# EAGLE design untitled (EAGLE 8.7.0)
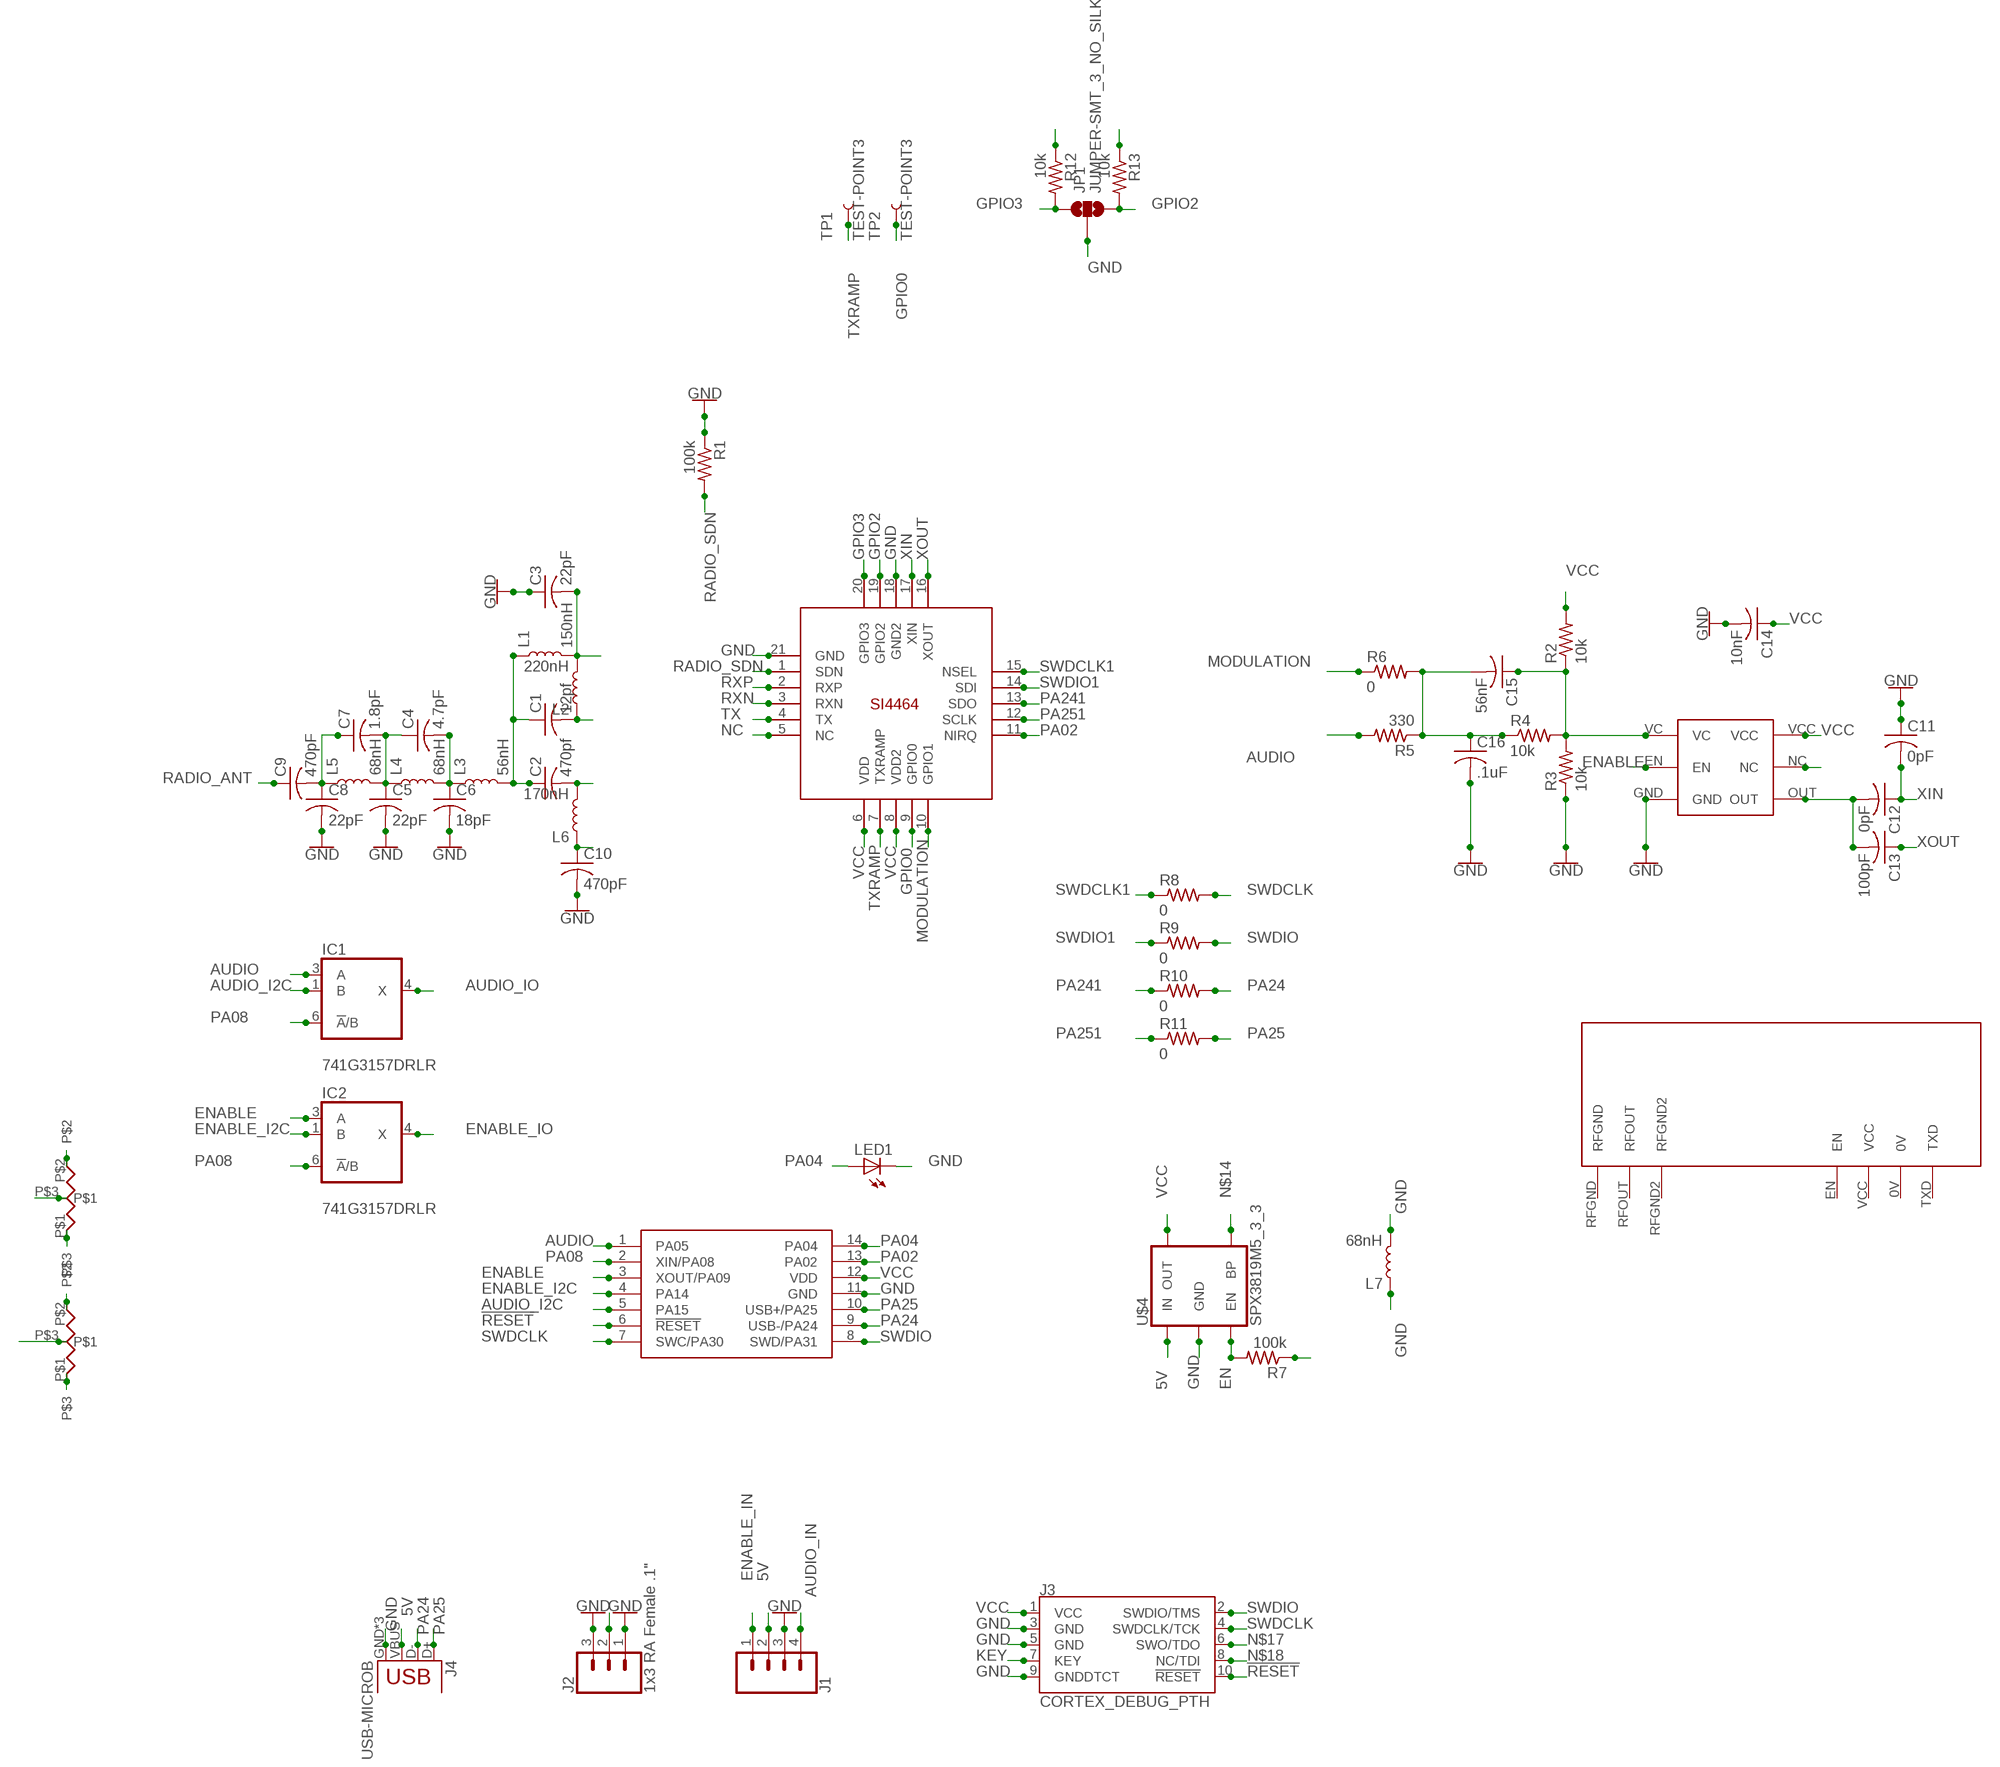
[diagram p0: schematic, sheet 1]

## Parts
C1  12pf  C-USC0402K  [C0402K]
C2  470pf  C-USC0402K  [C0402K]
C3  22pF  C-USC0402K  [C0402K]
C4  4.7pF  C-USC0402K  [C0402K]
C5  22pF  C-USC0402K  [C0402K]
C6  18pF  C-USC0402K  [C0402K]
C7  1.8pF  C-USC0402K  [C0402K]
C8  22pF  C-USC0402K  [C0402K]
C9  470pF  C-USC0402K  [C0402K]
C10  470pF  C-USC0402K  [C0402K]
C11  0pF  C-USC0402K  [C0402K]
C12  0pF  C-USC0402K  [C0402K]
C13  100pF  C-USC0402K  [C0402K]
C14  10nF  C-USC0402K  [C0402K]
C15  56nF  C-USC0402K  [C0402K]
C16  .1uF  C-USC0402K  [C0402K]
IC1  741G3157DRLR  [DRL_R-PDSO-N6]
IC2  741G3157DRLR  [DRL_R-PDSO-N6]
J1  CONN_04SMD_RA_FEMALE  [1X04_SMD_RA_FEMALE]
J2  1x3 RA Female .1"  CONN_03SMD_RA_FEMALE  [1X03_SMD_RA_FEMALE]
J3  CORTEX_DEBUG_PTH  [2X5-PTH-1.27MM]
J4  USB-MICROB  [USB-MICROB]
JP1  JUMPER-SMT_3_NO_SILK  [SMT-JUMPER_3_NO_SILK]
L1  150nH  INDUCTOR-0603-33NH  [0603]
L2  220nH  INDUCTOR-0603-33NH  [0603]
L3  56nH  INDUCTOR-0603-33NH  [0603]
L4  68nH  INDUCTOR-0603-33NH  [0603]
L5  68nH  INDUCTOR-0603-33NH  [0603]
L6  170nH  INDUCTOR-0603-33NH  [0603]
L7  68nH  INDUCTOR-0603-33NH  [0603]
LED1  LEDCHIP-LED0603  [CHIP-LED0603]
R1  100k  R-US_R0402  [R0402]
R2  10k  R-US_R0402  [R0402]
R3  10k  R-US_R0402  [R0402]
R4  10k  R-US_R0402  [R0402]
R5  330  R-US_R0402  [R0402]
R6  0  R-US_R0402  [R0402]
R7  100k  R-US_R0402  [R0402]
R8  0  R-US_R0402  [R0402]
R9  0  R-US_R0402  [R0402]
R10  0  R-US_R0402  [R0402]
R11  0  R-US_R0402  [R0402]
R12  10k  R-US_R0402  [R0402]
R13  10k  R-US_R0402  [R0402]
TP1  TEST-POINT3  [PAD.03X.03]
TP2  TEST-POINT3  [PAD.03X.03]
U$1  HC53BR-27  [OSCILLATOR-SMD-7.5X5.2-6PIN]
U$2  SI4464  [QFN20+GNDPAD]
U$3  SAMD11C14  [SOIC14]
U$4  SPX3819M5_3_3  V_REG_SPX3819-SOT23-5  [SOT23-5]
U$5  RM20A10K/20K  [RM20A10K/20K]
U$6  RM20A10K/20K  [RM20A10K/20K]
U$7  RADIOMETRIX-HX1  [RADIOMETRIX-HX1]

## Nets
5V: J1.2 J4.VBUS R7.1 U$4.1(IN)
!RESET: J3.10(!RESET) U$3.6(!RESET)
AUDIO: IC1.3(A) R5.2 U$3.1(PA05)
AUDIO_I2C: IC1.1(B) U$3.5(PA15)
AUDIO_IN: J1.4 U$6.P$1
AUDIO_IO: IC1.4(X) U$6.P$3
EN: R7.2 U$4.3(EN)
ENABLE: IC2.3(A) U$1.EN U$3.3(XOUT/PA09)
ENABLE_I2C: IC2.1(B) U$3.4(PA14)
ENABLE_IN: J1.1 U$5.P$1
ENABLE_IO: IC2.4(X) U$5.P$3
GND: C3.1 C5.2 C6.2 C8.2 C10.2 C11.1 C14.2 C16.2 J1.3 J2.1 J2.3 J3.3(GND) J3.5(GND) J3.9(GNDDTCT) J4.GND J4.MT1(GND) J4.MT2(GND) JP1.2 L7.1 L7.2 LED1.C R1.1 R3.1 U$1.GND U$2.18(GND2) U$2.21(GND) U$3.11(GND) U$4.2(GND) U$5.P$2 U$6.P$2
GPIO0: TP2.P$1 U$2.9(GPIO0)
GPIO2: JP1.3 R13.2 U$2.19(GPIO2)
GPIO3: JP1.1 R12.2 U$2.20(GPIO3)
KEY: J3.7(KEY)
MODULATION: R6.1 U$2.10(GPIO1)
N$1: C4.2 C6.1 L3.1 L4.2
N$2: C1.1 C2.1 L1.1 L3.2
N$3: C4.1 C5.1 C7.2 L4.1 L5.2
N$4: C15.2 C16.1 R4.1 R5.1 R6.2
N$5: C7.1 C8.1 C9.2 L5.1
N$6: C15.1 R2.1 R3.2 R4.2 U$1.VC
N$9: U$1.NC
N$14: U$4.4(BP)
N$17: J3.6(SWO/TDO)
N$18: J3.8(NC/TDI)
NC: U$2.5(NC )
OUT: C12.2 C13.2 U$1.OUT
PA02: U$2.11(NIRQ) U$3.13(PA02)
PA04: LED1.A U$3.14(PA04)
PA08: IC1.6(!A!/B) IC2.6(!A!/B) U$3.2(XIN/PA08)
PA24: J4.D- R10.2 U$3.9(USB-/PA24)
PA25: J4.D+ R11.2 U$3.10(USB+/PA25)
PA241: R10.1 U$2.13(SDO)
PA251: R11.1 U$2.12(SCLK)
RADIO_ANT: C9.1 J2.2
RADIO_SDN: R1.2 U$2.1(SDN)
RXN: C1.2 L2.1 U$2.3(RXN)
RXP: C3.2 L1.2 L2.2 U$2.2(RXP)
SWDCLK: J3.4(SWDCLK/TCK) R8.2 U$3.7(SWC/PA30)
SWDCLK1: R8.1 U$2.15(NSEL)
SWDIO: J3.2(SWDIO/TMS) R9.2 U$3.8(SWD/PA31)
SWDIO1: R9.1 U$2.14(SDI)
TX: C2.2 L6.2 U$2.4(TX)
TXRAMP: TP1.P$1 U$2.7(TXRAMP)
VCC: C10.1 C14.1 J3.1(VCC) L6.1 R2.2 R12.1 R13.1 U$1.VCC U$2.6(VDD) U$2.8(VDD2) U$3.12(VDD) U$4.5(OUT)
XIN: C11.2 C12.1 U$2.17(XIN)
XOUT: C13.1 U$2.16(XOUT)
Unconnected: U$7.0V U$7.EN U$7.RFGND U$7.RFGND2 U$7.RFOUT U$7.TXD U$7.VCC

## Power pins joined to a net without a drawn wire
GND: IC1.2(GND) IC2.2(GND)
VCC: IC1.5(VCC) IC2.5(VCC)

## Library data of the parts
C1-C16 = rcl:C-US: CAPACITOR, American symbol; SPICEPREFIX: C
IC1 IC2 = 74xx-little-us:74*1G3157: Single-Pole, Double-Throw Analog Switch Source: http://focus.ti.com/lit/ds/symlink/sn74lvc1g3157.pdf
J1 = SparkFun-Connectors:CONN_04: Multi connection point. Often used as Generic Header-pin footprint for 0.1 inch spaced/style header connections On any of the 0.1 inch spaced packages, you can populate with these: Break Away Headers - Straight <https://www.sparkfun.com/products/116> (PRT-00116) Break Away Male Headers - Right Angle <https://www.sparkfun.com/products/553> (PRT-00553) Female Headers <https://www.sparkfun.com/products/115> (PRT-00115) Break Away Headers - Machine Pin <https://www.sparkfun.com/products/117> (PRT-00117) Break Away Female Headers - Swiss Machine Pin <https://www.sparkfun.com/products/743> (PRT-00743) For SCREWTERMINALS and SPRING TERMINALS visit here: Screw Terimnals on SparkFun.com <https://www.sparkfun.com/search/results?term=Screw+Terminals> (5mm/3.5mm/2.54mm spacing) This device is also useful as a general connection point to wire up your design to another part of your project. Our various solder wires solder well into these plated through hole pads. Hook-Up Wire - Assortment (Stranded, 22 AWG) <https://www.sparkfun.com/products/11375> (PRT-11375) Hook-Up Wire - Assortment (Solid Core, 22 AWG) <https://www.sparkfun.com/products/11367> (PRT-11367) View the entire wire category on our website here <https://www.sparkfun.com/categories/141> Special notes: Molex polarized connector foot print use with SKU : PRT-08231 with associated crimp pins and housings. 1MM SMD Version SKU: PRT-10208; PROD_ID: CONN-12382
J2 = SparkFun-Connectors:CONN_03: Multi connection point. Often used as Generic Header-pin footprint for 0.1 inch spaced/style header connections On any of the 0.1 inch spaced packages, you can populate with these: Break Away Headers - Straight <https://www.sparkfun.com/products/116> (PRT-00116) Break Away Male Headers - Right Angle <https://www.sparkfun.com/products/553> (PRT-00553) Female Headers <https://www.sparkfun.com/products/115> (PRT-00115) Break Away Headers - Machine Pin <https://www.sparkfun.com/products/117> (PRT-00117) Break Away Female Headers - Swiss Machine Pin <https://www.sparkfun.com/products/743> (PRT-00743) Stackable Header - 3 Pin (Female, 0.1") <https://www.sparkfun.com/products/13875> (PRT-13875) For SCREWTERMINALS and SPRING TERMINALS visit here: Screw Terimnals on SparkFun.com <https://www.sparkfun.com/search/results?term=Screw+Terminals> (5mm/3.5mm/2.54mm spacing) This device is also useful as a general connection point to wire up your design to another part of your project. Our various solder wires solder well into these plated through hole pads. Hook-Up Wire - Assortment (Stranded, 22 AWG) <https://www.sparkfun.com/products/11375> (PRT-11375) Hook-Up Wire - Assortment (Solid Core, 22 AWG) <https://www.sparkfun.com/products/11367> (PRT-11367) View the entire wire category on our website here <https://www.sparkfun.com/categories/141> Special notes: Molex polarized connector foot print use with SKU : PRT-08232 with associated crimp pins and housings.; PROD_ID: CONN-10926
J3 = SparkFun-Connectors:CORTEX_DEBUG: Cortex Debug Connector - 10 pin Supports JTAG debug, Serial Wire debug, and Serial Wire Viewer. PTH and SMD connector options available. General Connector Information <http://infocenter.arm.com/help/topic/com.arm.doc.faqs/attached/13634/cortex_debug_connectors.pdf> Products: PTH Connector <http://www.digikey.com/product-detail/en/cnc-tech/3220-10-0100-00/1175-1627-ND/3883661> -via Digi-Key SparkFun PSoc <https://www.sparkfun.com/products/13229> SparkFun T <https://www.sparkfun.com/products/13810>
J4 = SparkFun-Retired:USB: USB Connectors USB-B-PTH is fully proven SKU : PRT-00139/CONN-08278 USB-miniB is fully proven SKU : PRT-00587 USB-A-PCB is untested. USB-A-H is throughly reviewed, but untested. Spark Fun Electronics SKU : PRT-00437 USB-B-SMT is throughly reviewed, but untested. Needs silkscreen touching up. USB-A-S has not been used/tested USB-MB-H has not been used/tested USB-MICROB has been used. CONN-09505; PROD_ID: CONN-09505
JP1 = SparkFun-Jumpers:JUMPER-SMT_3_NO: Normally open jumper This jumper has three pads in close proximity to each other. Apply solder to close the connection(s).
L1-L7 = SparkFun-Coils:INDUCTOR: Inductors Resist changes in electrical current. Basically a coil of wire. SparkFun Products: SparkFun Load Cell Amplifier - HX711 <https://www.sparkfun.com/products/13879> IOIO-OTG - V2.2 <https://www.sparkfun.com/products/13613>; PROD_ID: NDUC-07874; VALUE: 33nH/±5%/500mA
LED1 = adafruit:LED: LED OSRAM: - CHIPLED LG R971, LG N971, LY N971, LG Q971, LY Q971, LO R971, LY R971 LH N974, LH R974 LS Q976, LO Q976, LY Q976 LO Q996 - Hyper CHIPLED LW Q18S LB Q993, LB Q99A, LB R99A - SideLED LS A670, LO A670, LY A670, LG A670, LP A670 LB A673, LV A673, LT A673, LW A673 LH A674 LY A675 LS A676, LA A676, LO A676, LY A676, LW A676 LS A679, LY A679, LG A679 - Hyper Micro SIDELED® LS Y876, LA Y876, LO Y876, LY Y876 LT Y87S - SmartLED LW L88C, LW L88S LB L89C, LB L89S, LG L890 LS L89K, LO L89K, LY L89K LS L896, LA L896, LO L896, LY L896 - TOPLED LS T670, LO T670, LY T670, LG T670, LP T670 LSG T670, LSP T670, LSY T670, LOP T670, LYG T670 LG T671, LOG T671, LSG T671 LB T673, LV T673, LT T673, LW T673 LH T674 LS T676, LA T676, LO T676, LY T676, LB T676, LH T676, LSB T676, LW T676 LB T67C, LV T67C, LT T67C, LS T67K, LO T67K, LY T67K, LW E67C LS E67B, LA E67B, LO E67B, LY E67B, LB E67C, LV E67C, LT E67C LW T67C LS T679, LY T679, LG T679 LS T770, LO T770, LY T770, LG T770, LP T770 LB T773, LV T773, LT T773, LW T773 LH T774 LS E675, LA E675, LY E675, LS T675 LS T776, LA T776, LO T776, LY T776, LB T776 LHGB T686 LT T68C, LB T68C - Hyper Mini TOPLED® LB M676 - Mini TOPLED Santana® LG M470 LS M47K, LO M47K, LY M47K Source: http://www.osram.convergy.de/
R1-R13 = resistor:R-US_: RESISTOR, American symbol
TP1 TP2 = SparkFun-Connectors:TEST-POINT: SparkFun Test Points Bare copper test points for troubleshooting or In-Circuit-Testing. These are used by our Production team for verifying production board runs using pogo-pins on test beds. SparkFun Products: SparkFun LSM9DS1 Breakout <https://www.sparkfun.com/products/13284> SparkFun PSOC <https://www.sparkfun.com/products/13714> SparkFun Load Cell Amplifier <https://www.sparkfun.com/products/13879>
U$1 = SparkFun-Clocks-custom:HC53BR-27: HC53BR-27
U$2 = Ava:SI4464
U$3 = atmel_tiny24-44-84tiny48-88mega48-88-168-328:SAMD11C14
U$4 = SparkFun-IC-Power:V_REG_SPX3819: SPX3819 Voltage Regulator 3.3V 500mA, 16V input Datasheet <https://www.exar.com/content/document.ashx?id=22106> SparkFun Products: SparkFun Serial Controlled Motor Driver <https://www.sparkfun.com/products/13911>; PROD_ID: VREG-13321
U$5 U$6 = resistor:RM20A10K/20K
U$7 = Ava:RADIOMETRIX-HX1

## Board
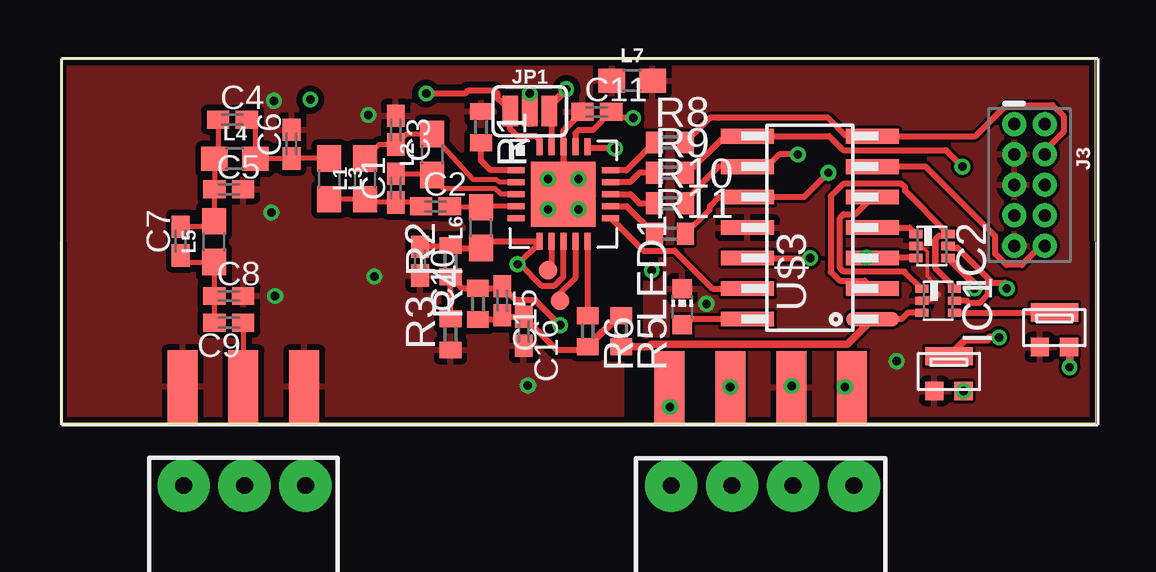
[diagram p1: board, top side]
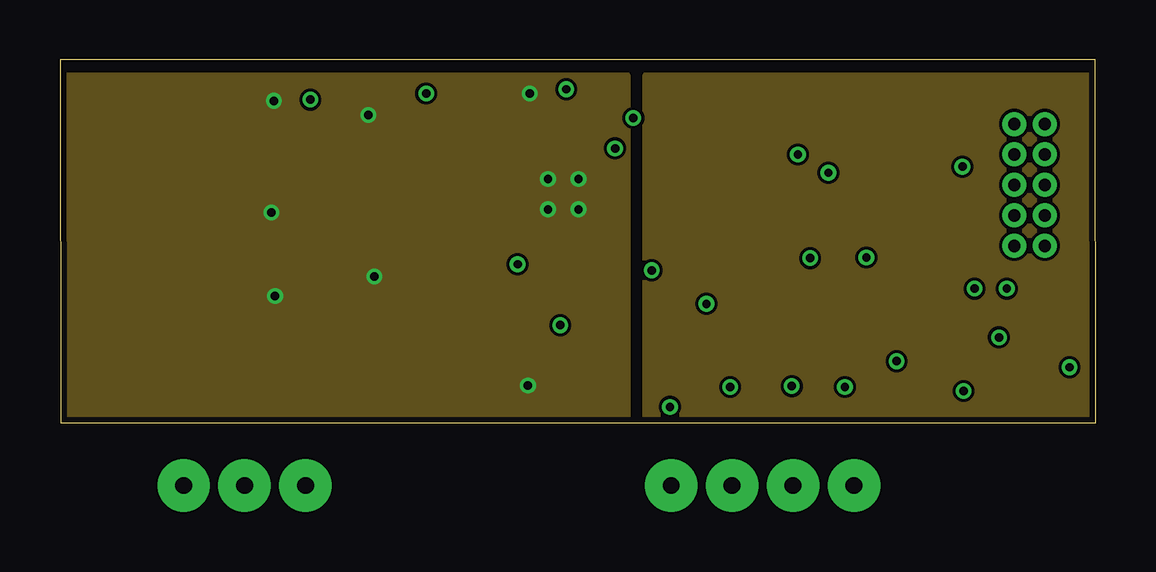
[diagram p2: board, inner layer Route2]
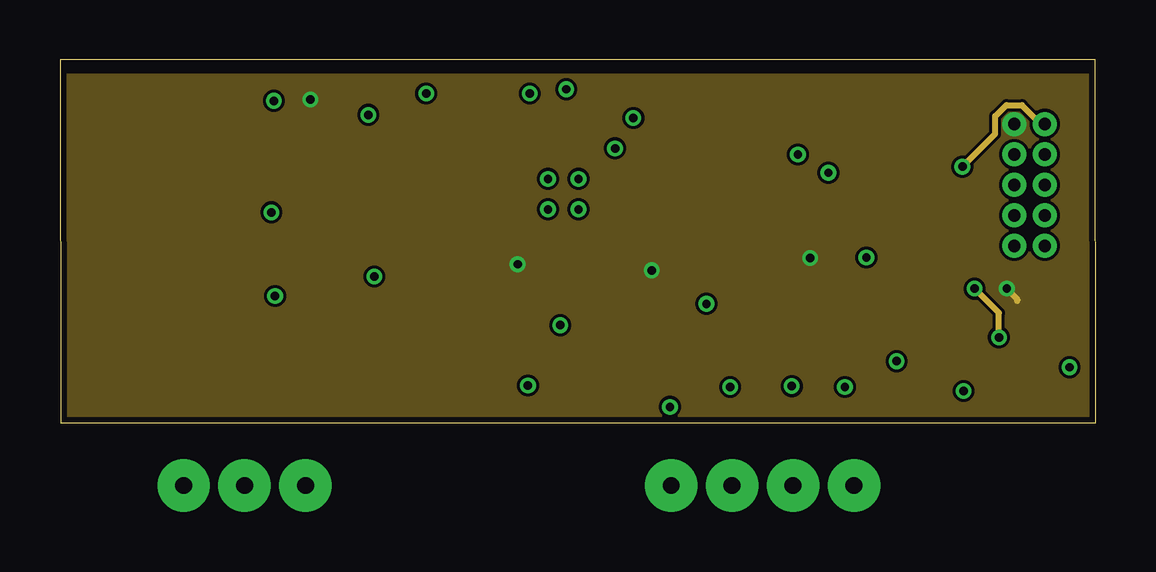
[diagram p3: board, inner layer Route15]
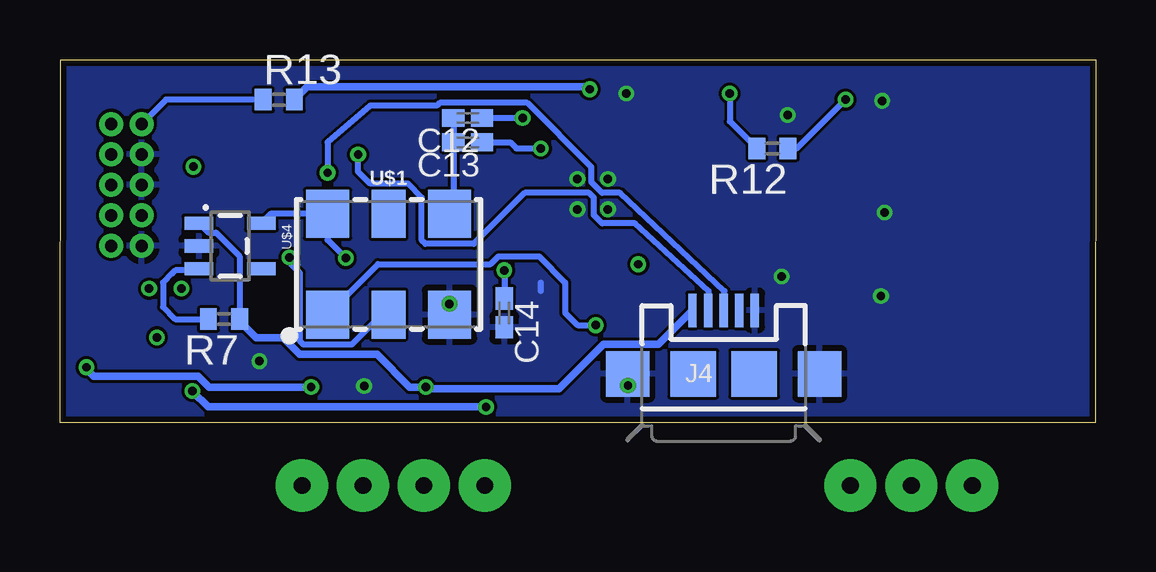
[diagram p4: board, bottom side, seen from below]

Size 43.19 x 15.11 mm. Coordinates in mm from the lower left corner, seen from the top.
Outline: 0.03,0 43.19,0 43.16,15.11 0,15.11 0.03,0
Copper layers (1*2*15*16): Top 0.035mm / dielectric 0.23mm / Route2 0.035mm / dielectric 0.93mm / Route15 0.035mm / dielectric 0.23mm / Bottom 0.035mm
Design rules "MF_Standard_4_Layer": minimum track width 5mil, minimum drill 12mil, track to track 5mil, track to pad 5mil, pad to pad 5mil, via to via 5mil, smd to smd 0mil, copper to edge 10mil, drill to drill 10mil, minimum pad ring 6mil, minimum via ring 6mil, stop-mask expansion 2mil, vias tented up to drill 25mil, thermal gap 10mil

### Footprints (pad centres in the part's own frame; a part is rotated, then mirrored left to right if it is on the bottom)
C0402K = smd 0.925 x 0.74: 1 -0.6,0; 2 0.6,0
DRL_R-PDSO-N6 = smd 0.35 x 0.55: 1 -0.5,-0.675; 2 0,-0.675; 3 0.5,-0.675; 4 0.5,0.675; 5 0,0.675; 6 -0.5,0.675
1X04_SMD_RA_FEMALE = smd 1.25 x 3: 1 -3.81,7.225; 2 -1.27,7.225; 3 1.27,7.225; 4 3.81,7.225
1X03_SMD_RA_FEMALE = smd 1.25 x 3: 1 -2.54,7.225; 2 0,7.225; 3 2.54,7.225
2X5-PTH-1.27MM = drill 0.508 pad 1: 1 -2.54,-0.635; 2 -2.54,0.635; 3 -1.27,-0.635; 4 -1.27,0.635; 5 0,-0.635; 6 0,0.635; 7 1.27,-0.635; 8 1.27,0.635; 9 2.54,-0.635; 10 2.54,0.635
USB-MICROB = smd 0.35 x 1.4: D+ 0,2.65; D- -0.65,2.65; GND 1.3,2.65; ID 0.65,2.65; VBUS -1.3,2.65 | smd 1.8 x 1.9: MT1 -4,0; MT2 4,0 | smd 1.9 x 1.9: P$1 -1.27,0; P$2 1.27,0
SMT-JUMPER_3_NO_SILK = smd 0.635 x 1.27: 1 -0.813,0; 2 0,0; 3 0.813,0
0603 = smd 1.1 x 1: 1 -0.85,0; 2 0.85,0
CHIP-LED0603 = smd 0.8 x 0.8: A 0,-0.75; C 0,0.75
R0402 = smd 0.7 x 0.9: 1 -0.65,0; 2 0.65,0
PAD.03X.03 = smd 0.762 x 0.762: P$1 0,0
OSCILLATOR-SMD-7.5X5.2-6PIN = smd 1.4 x 2: EN 0,-2.1; NC 0,2.1 | smd 1.8 x 2: GND 2.54,-2.1; OUT 2.54,2.1; VC -2.54,-2.1; VCC -2.54,2.1
QFN20+GNDPAD = smd 0.7 x 0.25: 1 -1.97,1; 2 -1.97,0.5; 3 -1.97,0; 4 -1.97,-0.5; 5 -1.97,-1; 11 1.97,-1; 12 1.97,-0.5; 13 1.97,0; 14 1.97,0.5; 15 1.97,1 | smd 0.25 x 0.7: 6 -1,-1.97; 7 -0.5,-1.97; 8 0,-1.97; 9 0.5,-1.97; 10 1,-1.97; 16 1,1.97; 17 0.5,1.97; 18 0,1.97; 19 -0.5,1.97; 20 -1,1.97 | smd 2.7 x 2.7: 21 0,0
SOIC14 = smd 0.61 x 2.21: 1 -3.81,-2.603; 2 -2.54,-2.603; 3 -1.27,-2.603; 4 0,-2.603; 5 1.27,-2.603; 6 2.54,-2.603; 7 3.81,-2.603; 8 3.81,2.603; 9 2.54,2.603; 10 1.27,2.603; 11 0,2.603; 12 -1.27,2.603; 13 -2.54,2.603; 14 -3.81,2.603
SOT23-5 = smd 0.55 x 1.2: 1 -0.95,-1.3; 2 0,-1.3; 3 0.95,-1.3; 4 0.95,1.3; 5 -0.95,1.3
RM20A10K/20K = smd 0.762 x 0.762: P$1 -0.61,0.813; P$2 0.61,0.813 | smd 1.981 x 0.762: P$3 0,-0.635
RADIOMETRIX-HX1 = drill 0.7 pad 2.184: 0V 8.89,-10.16; EN 3.81,-10.16; RFGND -11.43,-10.16; RFGND2 -16.51,-10.16; RFOUT -13.97,-10.16; TXD 11.43,-10.16; VCC 6.35,-10.16

### Placement (x,y rotation side)
C1  14,9.78 90 top
C2  15.65,9.02 0 top
C3  14,12.19 270 top
C4  7.19,12.62 0 top
C5  7.04,9.73 0 top
C6  9.65,11.61 90 top
C7  5.03,7.57 90 top
C8  7.04,5.28 0 top
C9  7.04,4.17 180 top
C10  15.01,6.73 270 top
C11  22.38,12.95 0 top
C12  26.19,12.7 180 bottom
C13  26.19,11.68 180 bottom
C14  24.66,4.57 270 bottom
C15  18.44,5.08 270 top
C16  19.33,3.81 270 top
IC1  36.6,5.08 270 top
IC2  36.35,7.37 270 top
J1  29.21,-5.74 0 top
J2  7.65,-5.71 0 top
J3  40.41,9.91 270 top
J4  15.52,2.03 0 bottom
JP1  19.58,12.98 0 top
L1  12.73,10.16 90 top
L2  15.52,11.18 90 top
L3  11.23,10.16 270 top
L4  7.29,11 0 top
L5  6.43,7.54 90 top
L6  17.55,8.13 90 top
L7  23.85,14.25 0 top
LED1  25.93,4.83 0 top
R1  17.55,12.32 270 top
R2  16.28,6.73 90 top
R3  16.28,3.68 90 top
R4  17.42,4.95 90 top
R5  23.39,3.81 270 top
R6  22,3.81 270 top
R7  36.35,4.32 180 bottom
R8  25.43,11.68 0 top
R9  25.43,10.41 0 top
R10  25.43,9.14 0 top
R11  25.43,7.87 0 top
R12  13.49,11.43 180 bottom
R13  34.06,13.46 0 bottom
TP1  20.35,6.35 0 top
TP2  20.85,5.08 0 top
U$1  29.49,6.6 0 bottom
U$2  20.98,9.53 0 top
U$3  31.27,8.13 90 top
U$4  36.09,7.37 270 bottom
U$5  37.06,2.13 180 top
U$6  41.45,3.96 180 top
U$7  21.67,7.54 0 top

### Tracks (layer width: path | path; a pad name or v marks a point on that pad's centre or on a via)
5V  (via drill 0.35)
  Bottom 0.254: U$4.1 37,7.92 36.68,7.92 35.7,6.94 R7.1
  Bottom 0.305: J4.VBUS 18.24,3.26 20.54,3.26 22.37,1.42 27.97,1.42 27.97,1.46 J1.2 28.61,1.49 29.97,2.84 33.2,2.84 33.89,3.53 35,3.53 35.7,4.23 R7.1
  other vias: 27.94,1.48
!RESET
  Top 0.254: J3.10 40.89,7.37 40.1,6.58 39.45,6.58 38.99,7.04 38.99,7.77 36.09,10.67 U$3.6
AUDIO
  Top 0.254: IC1.3 35.34,4.58 35.08,4.32 U$3.1
  Top 0.305: R5.2 24.56,3.16 24.66,3.26 32.82,3.26 U$3.1
AUDIO_I2C
  Top 0.254: IC1.1 35.21,6.3 32.66,6.3 32.51,6.45 32.51,8.54 32.66,8.69 33.16,8.69 U$3.5
AUDIO_IN  (via drill 0.35)
  Top 0.305: J1.4 33.02,2.06 33.05,2.08 33.05,1.81 v32.72,1.49 | v42.09,2.31 42.09,2.64 U$6.P$1
  Bottom 0.305: v32.72,1.49 36.97,1.49 37.42,1.93 41.78,1.93 42.11,2.26 v42.09,2.31
AUDIO_IO
  Top 0.254: IC1.4 40.17,4.58 40.69,4.6 U$6.P$3
EN
  Bottom 0.254: U$4.3 37.46,6.35 38.38,6.35 38.51,6.22 38.89,5.84 38.89,4.83 38.38,4.32 R7.2
ENABLE  (via drill 0.35)
  Top 0.254: IC2.3 33.61,6.87 | 33.61,6.87 v33.62,6.88 | U$3.3 33.62,6.86 33.61,6.87
  Bottom 0.254: U$1.EN 29.77,4.5 31.02,3.25 33.03,3.25 33.18,3.4 33.18,6.23 33.81,6.86 33.79,6.87 v33.62,6.88
ENABLE_I2C
  Top 0.254: U$3.4 35.41,8.13 IC2.1
ENABLE_IN  (via drill 0.35)
  Top 0.2: J1.1 25.58,1.31 25.58,0.64
  Top 0.305: 25.58,0.64 25.45,0.64 v25.43,0.66
  Bottom 0.305: v25.43,0.66 37.01,0.66 U$5.P$1
  other vias: 37.67,1.32
ENABLE_IO  (via drill 0.35)
  Top 0.305: U$5.P$3 37.74,3.45 38.66,3.45 38.76,3.56 v39.14,3.56 | IC2.4 38.13,5.76 v38.13,5.59
  Route15 0.254: v39.14,3.56 39.14,4.57 v38.13,5.59
GND  (via drill 0.35, 0.35 pad 0.55)
  Top 0.15: IC2.2 35.8,7.24 36.03,7.24 36.15,7.12 36.15,6.09 36.4,5.84 36.4,5.32 36.29,5.2 36.05,5.2 IC1.2
  Top 0.254: U$2.21 v21.62,8.89 | IC1.2 36,5.15 36.31,5.15 36.49,5.33 36.6,5.33 | v21.62,10.16 20.98,10.79 U$2.18 20.98,12.16 C11.1
  Bottom 0.254: 23.14,5.5 23.14,5.84
  other vias: 20.35,10.16 20.35,8.89 8.97,5.28 8.81,8.76 13.11,6.1 12.85,12.83 8.92,13.41 19.51,1.55 34.87,2.57 19.58,13.72 30.51,1.52 26.95,4.95
  pour Top (isolate 0.254): 0.03,15.11 23.39,15.11 23.39,0 0.03,0
  pour Top: 24.46,15.14 24.41,0 43.21,0 43.26,15.14
  pour Route2: -1.24,14.48 23.65,14.48 23.65,0 -1.24,0
  pour Bottom: -0.46,15.14 43.23,15.14 43.21,0 -0.48,0
GPIO0
  Top 0.254: U$2.9 21.48,6.03 20.85,5.41 TP2.P$1
GPIO2  (via drill 0.35)
  Top 0.254: U$2.19 20.48,12.56 20.4,12.65 JP1.3
  Top 0.305: v21.11,13.89 20.4,13.18 JP1.3
  Bottom 0.305: R13.2 32.88,13.99 21.21,13.99 v21.11,13.89
GPIO3  (via drill 0.35)
  Top 0.254: U$2.20 19.98,11.79 19.84,11.94 19.08,11.94 18.77,12.24 JP1.1 18.26,13.49 18.26,13.68 18.11,13.83 17,13.83 16.89,13.72 v15.27,13.72
  Bottom 0.254: v15.27,13.72 15.27,12.56 R12.2
MODULATION
  Top 0.254: U$2.10 21.98,4.48 R6.1
N$1
  Top 0.2: L3.1 C6.1 8.15,11.01 L4.2 8.14,12.27 C4.2
N$2
  Top 0.2: C2.1 15.05,9.18 C1.1 12.73,9.18 L1.1 L3.2
N$3
  Top 0.2: C4.1 6.59,11.15 L4.1 C5.1 6.44,8.4 L5.2 6.2,8.17 C7.2
N$4
  Top 0.254: R4.1 18.26,4.3 C15.2 18.51,4.41 C16.1 20.69,3.05 21.88,3.05 R6.2 22,3.3
  Top 0.305: R6.2 23.3,4.46 R5.1
N$5
  Top 0.2: C7.1 5.3,6.69 L5.1 C8.1 C9.2
N$6  (via drill 0.35)
  Top 0.254: R3.2 R2.1 16.76,5.6 R4.2 18.36,5.6 C15.1 | C15.1 18.53,5.59 | C15.1 18.99,5.13 19.8,5.13 19.95,4.98 19.95,4.96 v20.85,4.06
  Bottom 0.254: U$1.VC 29.93,6.6 25.23,6.6 24.9,6.93 23.21,6.93 22.12,5.84 22.12,4.57 21.62,4.06 v20.85,4.06
N$10
  pour Route2: 24.41,14.48 42.95,14.48 43.21,14.22 43.21,0.25 24.41,0.25
OUT
  Bottom 0.254: C12.2 C13.2 26.79,8.87 U$1.OUT
PA02
  Top 0.254: U$2.11 22.97,8.53 24.32,7.17 25.62,7.17 27.2,5.59 U$3.13
PA04
  Top 0.254: U$3.14 26.18,4.32 LED1.A
PA08
  Top 0.15: 36.94,7.95 36.72,7.74 36.66,7.74 36.55,7.62 36.55,6.31 IC1.6
  Top 0.254: U$3.2 33.54,5.92 32.5,5.92 32.13,6.29 32.13,9.43 32.66,9.96 35.08,9.96 35.23,9.81 35.23,9.66 36.94,7.95 IC2.6 36.95,7.79 36.64,7.79 36.49,7.65 36.49,6.43 37.28,5.64 IC1.6
PA24  (via drill 0.35)
  Top 0.254: v30.76,11.18 30,11.18 29.49,10.67 U$3.9 27.46,10.67 26.68,9.89 26.68,9.86 26.08,9.26 R10.2
  Bottom 0.254: J4.D- 16.14,4.9 16.14,5.49 19.21,8.31 20.59,8.31 20.93,8.65 20.93,9.38 21.13,9.58 23.82,9.58 25.94,7.45 27.95,7.45 28.1,7.6 28.1,9.38 28.68,9.96 30.25,9.96 30.76,10.47 v30.76,11.18
PA25  (via drill 0.35)
  Top 0.254: v32.03,10.41 31.01,9.4 U$3.10 27.46,9.4 27.08,9.03 27.08,8.88 R11.2
  Bottom 0.254: J4.D+ 15.49,4.9 15.49,5.49 19.83,9.58 20.59,9.58 21.03,10.03 21.03,10.65 23.7,13.32 27.36,13.32 27.47,13.21 30.25,13.21 32.03,11.68 v32.03,10.41
PA241
  Top 0.254: U$2.13 23.77,9.53 24.16,9.14 R10.1
PA251
  Top 0.254: U$2.12 23.62,9.03 R11.1
RADIO_ANT
  Top 0.2: C9.1 7.65,4.16 J2.2
RADIO_SDN
  Top 0.254: U$2.1 17.95,10.53 17.55,10.92 R1.2
RXN
  Top 0.2: C1.2 15.34,10.38 L2.1 15.96,9.76 18.15,9.76 18.38,9.53 U$2.3
RXP
  Top 0.2: U$2.2 18.34,10.03 18.18,10.13 17.23,10.13 L2.2 14.43,12.03 C3.2 13.31,11.59 L1.2
SWDCLK
  Top 0.254: J3.4 41.05,11.33 41.83,12.12 41.83,12.77 41.37,13.23 39.45,13.23 38.15,11.94 U$3.7 32.79,11.94 32.03,12.7 27.46,12.7 27.09,12.7 R8.2
SWDCLK1
  Top 0.254: R8.1 23.61,10.52 22.96,10.52 U$2.15
SWDIO  (via drill 0.35)
  Top 0.254: v37.62,10.67 36.93,11.35 32.65,11.35 32.07,11.94 U$3.8 27.71,11.94 26.19,10.41 R9.2
  Route15 0.254: v37.62,10.67 38.99,12.04 38.99,12.77 39.45,13.23 40.1,13.23 40.89,12.45 J3.2
SWDIO1
  Top 0.254: R9.1 24.16,10.41 23.77,10.03 U$2.14
TX
  Top 0.2: U$2.4 17.6,9.03 | L6.2 16.29,8.98
  Top 0.254: 17.6,9.03 L6.2 | 16.29,8.98 C2.2
TXRAMP
  Top 0.254: U$2.7 20.48,6.49 TP1.P$1
VCC  (via drill 0.35, 0.35 pad 0.55)
  Top 0.254: U$3.12 v31.27,6.86 | C10.1 16.23,7.33 R2.2 16.38,7.28 L6.1 17.83,7.55 U$2.6 19.98,7.51 v19.08,6.6 19.19,6.6 20.08,5.71 20.61,5.71 20.98,6.09 U$2.8 | IC1.5 37.81,5.08 37.88,5.01 38.37,5.01 38.71,5.35 38.71,5.99 | 38.71,5.99 37.4,7.29 37.09,7.29 IC2.5 | 38.71,5.99 38.86,5.84 39.4,5.84 39.4,5.66 v39.47,5.59
  Route15 0.254: v39.47,5.59 39.9,5.15 39.9,5.08
  Bottom 0.254: v31.27,6.86 32.03,7.62 U$1.VCC 34.41,8.7 U$4.5 | v24.66,6.35 C14.1 | v10.44,13.46 12.47,11.43 12.73,11.43 | 12.73,11.43 R12.1 | 12.84,11.32 12.73,11.43 | R13.1 38.76,13.46 J3.1
  pour Route15 (no thermals): 0.03,14.48 43.46,14.48 43.46,0 0.03,0
XIN  (via drill 0.35)
  Top 0.254: v23.9,12.7 23.23,12.7 C11.2 22.22,12.19 21.62,12.19 21.48,12.06 U$2.17
  Bottom 0.254: C12.1 v23.9,12.7
XOUT  (via drill 0.35)
  Top 0.254: v23.14,11.43 22.05,11.43 U$2.16
  Bottom 0.254: C13.1 24.41,11.68 24.16,11.43 v23.14,11.43